# Altium schematic sheet FPGA_52_C_165B_ASM_Buzzer.SchDoc
size B; Organization: Altium Limited; Address1: L3, 12a Rodborough Rd; Address2: Frenchs Forest; Address3: NSW; Address4: Australia 2086; DocumentNumber: 1; SheetNumber: 1; SheetTotal: 3
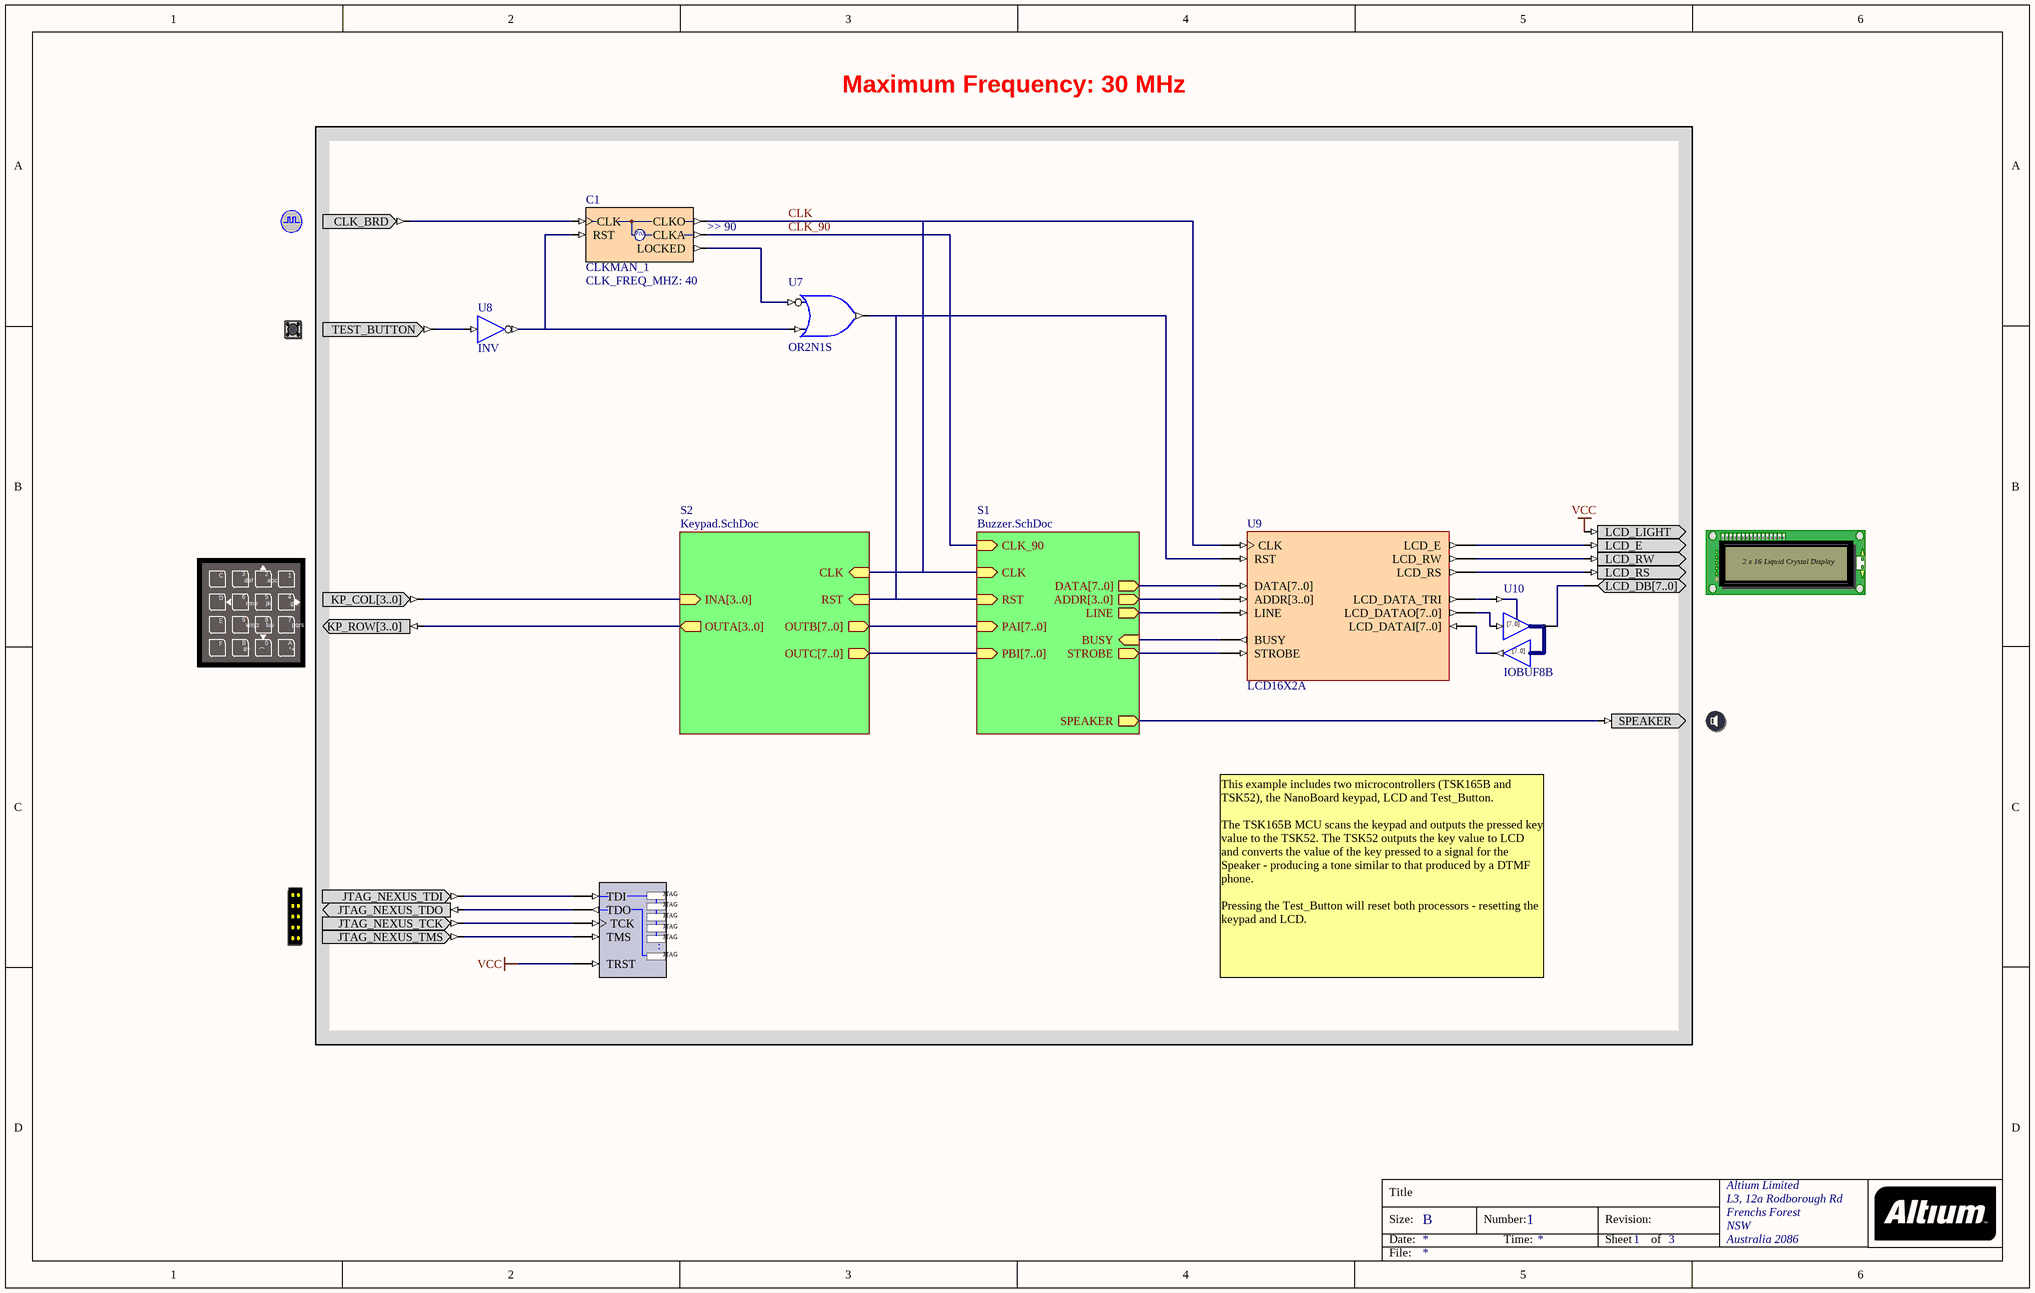
[diagram p0: FPGA_52_C_165B_ASM_Buzzer.SchDoc]

## Parts
(Parts that share a designator on the sheet are numbered #1, #2 ... from top to bottom, then left to right.)
?#1  CLOCK_BOARD  (value not drawn)
?#2  TEST_BUTTON  (value not drawn)
?#3  LCD  (value not drawn)
?#4  KEYPAD  (value not drawn)
?#5  SPEAKER  (value not drawn)
?#6  NEXUS_JTAG_CONNECTOR  (value not drawn)
C1  CLKMAN_1  CLK_FREQ_MHZ: 40  ClkA_Operation: >> 90
NEXUS_JTAG_PORT  NEXUS_JTAG_PORT  (value not drawn)
U7  OR2N1S
U8  INV
U9  LCD16X2A
U10  IOBUF8B

## Sub-sheets
S1 = Buzzer.SchDoc: CLK (in), RST (in), PAI[7..0] (in), PBI[7..0] (in), DATA[7..0] (out), ADDR[3..0] (out), LINE (out), BUSY (in), STROBE (out), SPEAKER (out), CLK_90 (in)
S2 = Keypad.SchDoc: CLK (in), OUTA[3..0] (out), INA[3..0] (in), OUTB[7..0] (out), RST (in), OUTC[7..0] (out)

## Nets
VCC: ?#3.LCD_LIGHT NEXUS_JTAG_PORT.TRST
CLK: C1.CLKO U9.CLK ; sheet S1/CLK, sheet S2/CLK
CLK_90: C1.CLKA ; sheet S1/CLK_90
Net?#1_CLK_BRD: ?#1.CLK_BRD C1.CLK
Net?#2_TEST_BUTTON: ?#2.TEST_BUTTON U8.I
Net?#3_LCD_DB[7..0]: ?#3.LCD_DB[7..0] U10.IO[7..0]
Net?#3_LCD_E: ?#3.LCD_E U9.LCD_E
Net?#3_LCD_RS: ?#3.LCD_RS U9.LCD_RS
Net?#3_LCD_RW: ?#3.LCD_RW U9.LCD_RW
Net?#4_KP_COL[3..0]: ?#4.KP_COL[3..0] ; sheet S2/INA[3..0]
Net?#4_KP_ROW[3..0]: ?#4.KP_ROW[3..0] ; sheet S2/OUTA[3..0]
Net?#5_SPEAKER: ?#5.SPEAKER ; sheet S1/SPEAKER
Net?#6_JTAG_NEXUS_TCK: ?#6.JTAG_NEXUS_TCK NEXUS_JTAG_PORT.TCK
Net?#6_JTAG_NEXUS_TDI: ?#6.JTAG_NEXUS_TDI NEXUS_JTAG_PORT.TDI
Net?#6_JTAG_NEXUS_TDO: ?#6.JTAG_NEXUS_TDO NEXUS_JTAG_PORT.TDO
Net?#6_JTAG_NEXUS_TMS: ?#6.JTAG_NEXUS_TMS NEXUS_JTAG_PORT.TMS
NetC1_LOCKED: C1.LOCKED U7.I0
NetC1_RST: C1.RST U7.I1 U8.O
NetU7_O: U7.O U9.RST ; sheet S1/RST, sheet S2/RST
NetU9_ADDR[3..0]: U9.ADDR[3..0] ; sheet S1/ADDR[3..0]
NetU9_BUSY: U9.BUSY ; sheet S1/BUSY
NetU9_DATA[7..0]: U9.DATA[7..0] ; sheet S1/DATA[7..0]
NetU9_LCD_DATA_TRI: U9.LCD_DATA_TRI U10.T
NetU9_LCD_DATAI[7..0]: U9.LCD_DATAI[7..0] U10.O[7..0]
NetU9_LCD_DATAO[7..0]: U9.LCD_DATAO[7..0] U10.I[7..0]
NetU9_LINE: U9.LINE ; sheet S1/LINE
NetU9_STROBE: U9.STROBE ; sheet S1/STROBE

## Buses and harness runs
bus sheet S1/PAI[7..0] = sheet S2/OUTB[7..0]
bus sheet S1/PBI[7..0] = sheet S2/OUTC[7..0]

## Notes on the sheet
- Maximum Frequency: 30 MHz
- This example includes two microcontrollers (TSK165B and TSK52), the NanoBoard keypad, LCD and Test_Button.
  The TSK165B MCU scans the keypad and outputs the pressed key value to the TSK52. The TSK52 outputs the key value to LCD and converts the value of the key pressed to a signal for the Speaker - producing a tone similar to that produced by a DTMF phone.
  Pressing the Test_Button will reset both processors - resetting the keypad and LCD.
- Title
- Size:
- Date:
- B
- Number:
- Time:
- Revision:
- Sheet
- of
- File:
- (in symbol CLKMAN_1) F(x)
- (in symbol IOBUF8B) [7..0]
- (in symbol KEYPAD) C; 3; 2; 1; def; abc; 6; 5; 4; D; mno; jkl; ghi; E; 9; 8; 7; wxyz; tuv; pqrs; F; B; 0; A; #^; (; *+
- (in symbol LCD) 2 x 16 Liquid Crystal Display
- (in symbol NEXUS_JTAG_PORT) JTAG; .

## Library data of the parts
?#1 = CLOCK_BOARD: Global System Clock Supply; PortComponent: True; Published: 19-Nov-2003; Publisher: Altium Limited
?#2 = TEST_BUTTON: Test Button; PortComponent: True; Published: 19-Nov-2003; Publisher: Altium Limited
?#3 = LCD: Liquid Crystal Display; PortComponent: True; Published: 19-Nov-2003; Publisher: Altium Limited
?#4 = KEYPAD: Key Pad; PortComponent: True; Published: 19-Nov-2003; Publisher: Altium Limited
?#5 = SPEAKER: Sound interface; PortComponent: True; Published: 19-Nov-2003; Publisher: Altium Limited
?#6 = NEXUS_JTAG_CONNECTOR: JTAG Port; PortComponent: True; Published: 19-Nov-2003; Publisher: Altium Limited
C1 = CLKMAN_1: Single Operational Output Clock Manager; Clk_Count: 1; Published: 5-Jul-2004; Publisher: Altium Limited; Core Revision: 1.00.00; Nexus_Core: ClockManager; HelpURL: CR0118 FPGA Generic Library Guide.pdf#page=148; Functional Class: Clock Manager; Port Size: 1
NEXUS_JTAG_PORT = NEXUS_JTAG_PORT: Soft Nexus-Chain Connector; NEXUS_JTAG_CONNECTOR: True; Published: 18-Dec-2003; Publisher: Altium Limited
U7 = OR2N1S: 2-Input OR Gate with Active Low A Input, Single Pin Version; Xilinx Equivalent: OR2B1; ArchiveName: GENERIC; VHDLIB_SIM: GENERIC_LIB; Published: 29-Jan-2004; Publisher: Altium Limited; Core Revision: 1.00.00
U8 = INV: Inverter; ArchiveName: GENERIC; VHDLIB_SIM: GENERIC_LIB; Published: 29-Jan-2004; Publisher: Altium Limited; Xilinx Equivalent: INV; Core Revision: 1.00.00
U9 = LCD16X2A: LCD Controller; Published: 5/01/2004; Publisher: Altium Hobart Technology Centre; Core Revision: 1.00.00
U10 = IOBUF8B: 8-Bit Input/Output Buffer, Bus Version; ArchiveName: GENERIC; Published: 18-Dec-2003; Publisher: Altium Limited; Core Revision: 1.00.00